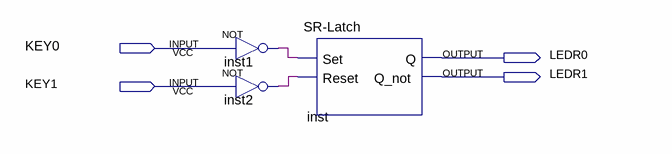
[diagram p0: schematic sheet]
// Quartus schematic Testbench.bdf as structural Verilog: 3 symbols, 4 pins
module Testbench (
  input  KEY0,
  input  KEY1,
  output LEDR0,
  output LEDR1
);

  wire inst1_out, inst2_out;

  not inst1 (inst1_out, KEY0);
  not inst2 (inst2_out, KEY1);
  \SR-Latch  inst (.Set(inst1_out), .Reset(inst2_out), .Q(LEDR0), .Q_not(LEDR1));
endmodule
